# EAGLE schematic Nixie_Board_Schematic (EAGLE 8.5.0)
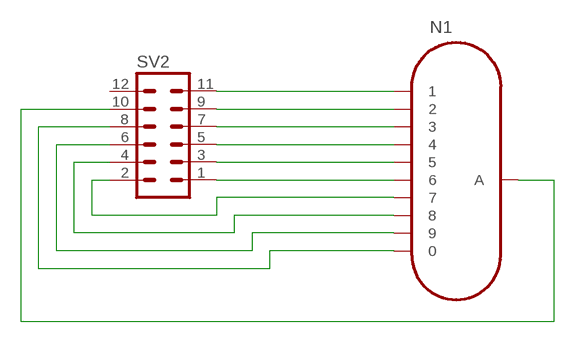
[diagram p0: schematic, sheet 1]

## Parts
N1  IN-8  [IN-8]
SV2  MA06-2  [MA06-2]

## Nets
N$1: N1.1 SV2.11
N$2: N1.2 SV2.9
N$3: N1.3 SV2.7
N$4: N1.4 SV2.5
N$5: N1.5 SV2.3
N$6: N1.6 SV2.1
N$7: N1.7 SV2.2
N$8: N1.8 SV2.4
N$9: N1.9 SV2.6
N$10: N1.0 SV2.8
N$11: N1.A SV2.10
Unconnected: SV2.12

## Library data of the parts
N1 = russian-nixies:IN-8: IN-8: medium numeric frontview nixie tube
SV2 = con-lstb:MA06-2: PIN HEADER; OC_FARNELL: unknown; OC_NEWARK: unknown